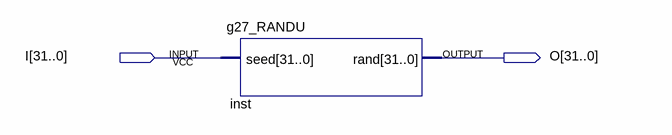
[diagram p0: schematic sheet]
// Quartus schematic g27_RANDU_Schematic.bdf as structural Verilog: 1 symbols, 2 pins
module g27_RANDU_Schematic (
  input  [31:0] I,
  output [31:0] O
);

  g27_RANDU inst (.seed(I), .\rand (O));
endmodule
